# Altium schematic sheet 5.SchDoc: Наименование
size 209 x 297 mm; ApprovedBy: Утвердил; CheckedBy: Проверил; Author: Разработал; CompanyName: Организация; DrawnBy: Н.Контр; Engineer: Т.Контр; SheetNumber: 1; SheetTotal: 1; PageSetup: Record=PageOptions|CenterHorizontal=True|CenterVertical=True|PrintScale=0.94|XCorrection=1.00|YCorrection=1.00|PrintKind=1|BorderSize=5000000|LeftOffset=0|BottomOffset=0|Orientation=1|PaperLength=1000|PaperWidth=1000|Scale=100|PaperSource=7|PrintQuality=-4|MediaType=1|DitherType=10|PaperKind=A4|PrintScaleMode=1; DecimalNumber: Децимальный номер; HeadOfSector: Нач. сектора; MainDevice: Перв.примен.; Name: Наименование; DocumentName: Sheet1.SCHDOC
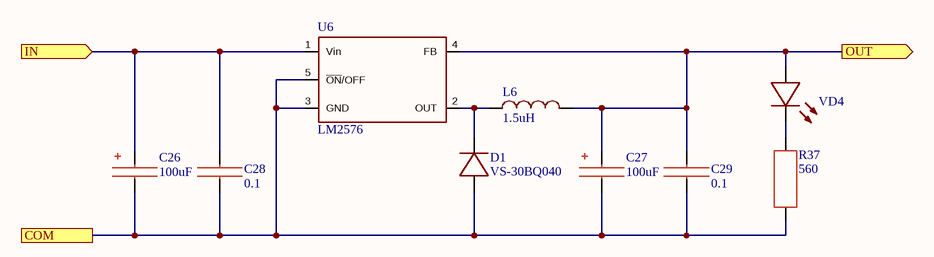
[diagram p0: 5.SchDoc]

## Parts
C26  100uF  [TANTAL TYPE D]
C27  100uF  [TANTAL TYPE D]
C28  0.1  [CC0805_3D]
C29  0.1  [CC0805_3D]
D1  VS-30BQ040  [DO-214AB]
L6  1.5uH  [SDR1105]
R37  560  [RC0805_3D]
U6  LM2576  [TO263-5]
VD4  Value  [2030]  (value not drawn)

## Ports
COM, IN (in), OUT (out)

## Nets
COM: C26.1 C27.1 C28.1 C29.1 D1.2 R37.1 U6.3(GND) U6.5(~{ON}/OFF) ; port COM
IN: C26.2 C28.2 U6.1(Vin) ; port IN
OUT: C27.2 C29.2 L6.2 U6.4(FB) VD4.2 ; port OUT
NetD1_1: D1.1 L6.1 U6.2(OUT)
NetR37_2: R37.2 VD4.1

## Notes on the sheet
- Подп. и дата
- Инв.№ дубл.
- Взам.инв.№
- Подп.и дата
- Инв.№ подл.
- Изм.
- Лист
- № докум.
- Подп.
- Дата
- Формат  A4

## Library data of the parts
C26 C27 = Tantal D 100uF: Value: 100uF
C28 C29 = CC0805 X uF: Value: 0.1
D1 = VS-30BQ040: High Performance Schottky Rectifier, 3.0 A
L6 = SDR1105: value: 2.5uH; value: 3.3uH; value: 3.9uH; value: 4.7uH; value: 5.6uH; value: 6.8uH; value: 7.5uH; value: 8.2uH; value: 10uH; value: 12uH; value: 15uH; value: 18uH; value: 22uH; value: 27uH; value: 33uH; value: 39uH; value: 47uH; value: 56uH; value: 68uH; value: 82uH; value: 100uH; value: 120uH; value: 150uH; value: 180uH; value: 220uH; value: 270uH; value: 330uH; value: 390uH; value: 470uH; value: 560uH; value: 680uH; value: 820uH; value: 1000uH; value: 1200uH; value: 1500uH; value: 1800uH; value: 2200uH; value: 2700uH; value: 3300uH; value: 3900uH; value: 4700uH; value: 1.5uH
R37 = RC0805 X Ohm: Value: 560
U6 = LM2576: SIMPLE SWITCHER® 3A Step-Down Voltage Regulator
VD4 = KA-3021SGCT